# Altium schematic sheet Temperature Sensing 12S V0.1.SchDoc
size A4; SheetNumber: 8; SheetTotal: 9
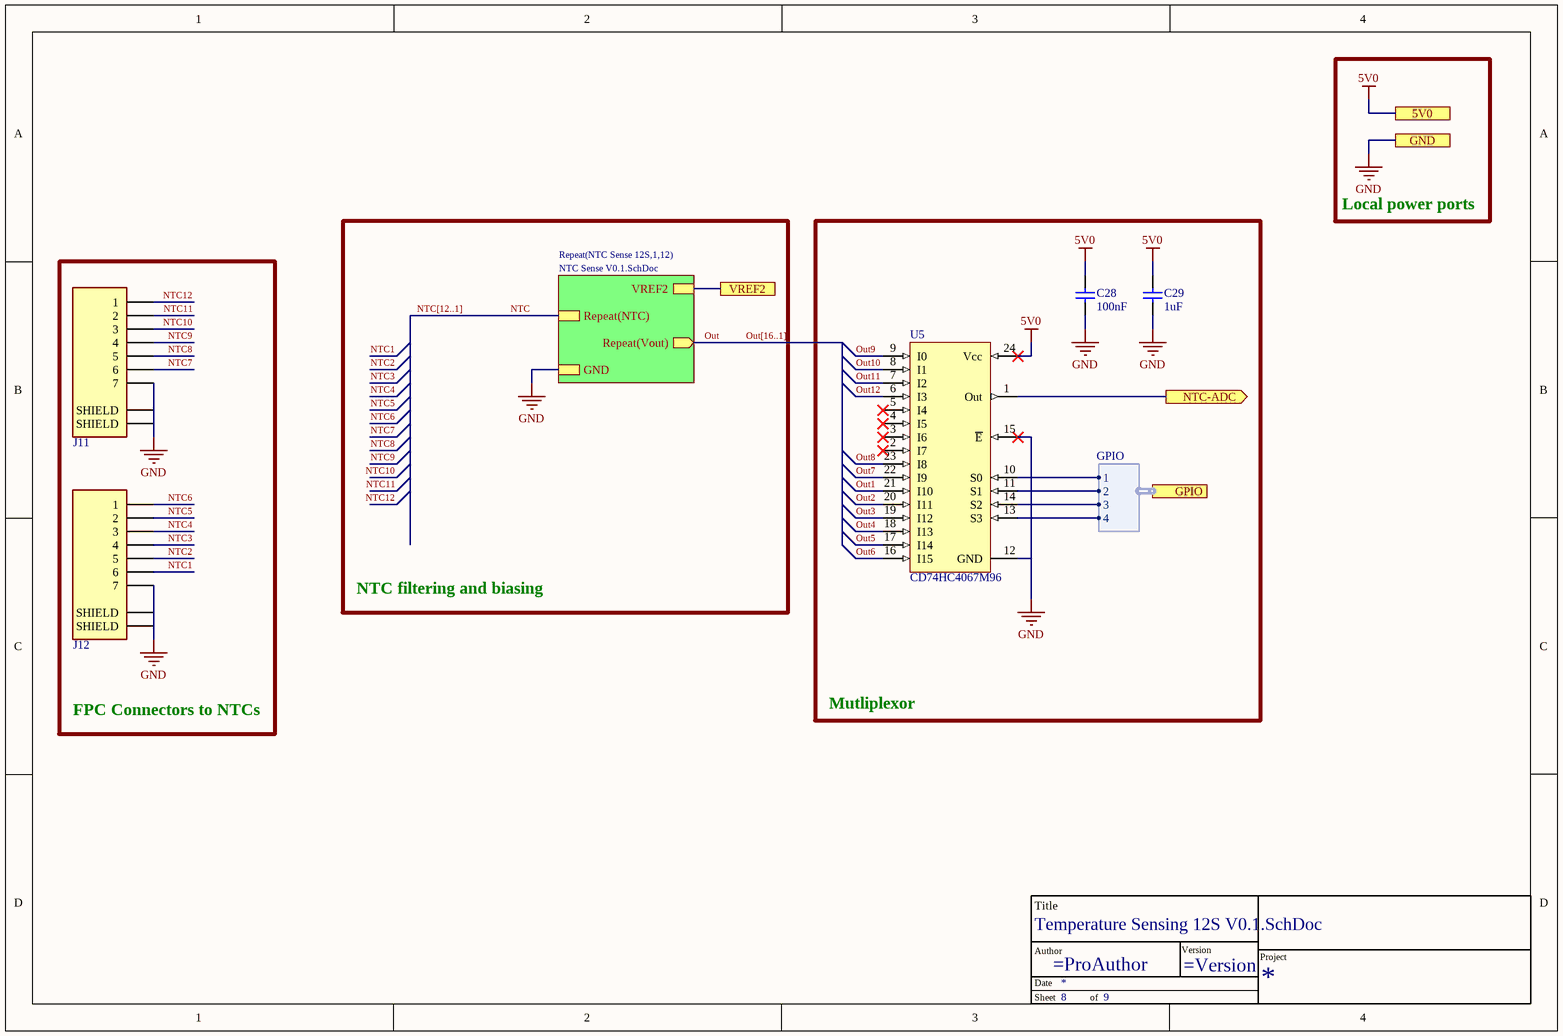
[diagram p0: Temperature Sensing 12S V0.1.SchDoc]

## Parts
*?  TitleBlock  (value not drawn)  (graphical)
C28  value 100nF  [C_0402]  (hidden comment: GRM155R62A104KE14D)
C29  value 1uF  [C_0402]  (hidden comment: EMK105BJ105KV-F)
J11  84953-7  [84953-7]  (value not drawn)
J12  84953-7  [84953-7]  (value not drawn)
U5  CD74HC4067M96  [SOIC127P1030X265-24N]

## Blocks framed on the sheet
Mutliplexor: C28 C29 U5
FPC Connectors to NTCs: J11 J12

## Sub-sheets
Repeat(NTC Sense 12S,1,12) = NTC Sense V0.1.SchDoc: VREF2, Repeat(Vout) (out), Repeat(NTC), GND

## Ports
5V0, GND, GPIO (harness GPIO), NTC-ADC (out), VREF2

## Harnesses
GPIO: 4, 3, 2, 1

## Nets
5V0: C28.1 C29.2 U5.24(Vcc) ; port 5V0
GND: C28.2 C29.1 J11.7 J11.S1(SHIELD) J11.S2(SHIELD) J12.7 J12.S1(SHIELD) J12.S2(SHIELD) U5.12(GND) U5.15(~{E}) ; port GND, sheet Repeat(NTC Sense 12S,1,12)/GND
NTC: sheet Repeat(NTC Sense 12S,1,12)/Repeat(NTC)
NTC1: J12.6
NTC2: J12.5
NTC3: J12.4
NTC4: J12.3
NTC5: J12.2
NTC6: J12.1
NTC7: J11.6
NTC8: J11.5
NTC9: J11.4
NTC10: J11.3
NTC11: J11.2
NTC12: J11.1
NTC-ADC: U5.1(Out) ; port NTC-ADC
Out: sheet Repeat(NTC Sense 12S,1,12)/Repeat(Vout)
Out1: U5.21(I10)
Out2: U5.20(I11)
Out3: U5.19(I12)
Out4: U5.18(I13)
Out5: U5.17(I14)
Out6: U5.16(I15)
Out7: U5.22(I9)
Out8: U5.23(I8)
Out9: U5.9(I0)
Out10: U5.8(I1)
Out11: U5.7(I2)
Out12: U5.6(I3)
VREF2: port VREF2, sheet Repeat(NTC Sense 12S,1,12)/VREF2
NetU5_10: U5.10(S0) ; port GPIO.1
NetU5_11: U5.11(S1) ; port GPIO.2
NetU5_13: U5.13(S3) ; port GPIO.4
NetU5_14: U5.14(S2) ; port GPIO.3

Not connected (* = marked no-connect by the designer): U5 2(I7)* 3(I6)* 4(I5)* 5(I4)*

## Buses and harness runs
bus NTC[12..1]
bus Out[16..1]

## Notes on the sheet
- Local power ports
- NTC filtering and biasing
- (in symbol TitleBlock) Title; Author; Version; Project; Date; Sheet; of

## Library data of the parts
C28 C29 = Capacitor: ComponentLink1Description: New link; ComponentLink1URL: *
  C28: Manufacture Part Number 1: GRM155R62A104KE14D
J11 J12 = 84953-7: FPC Connectors, Flex-to-Board, 7 Position, .039 in [1 mm] Centerline, Zero Insertion Force (ZIF), Right Angle, Surface Mount; Manufacturer: TE Connectivity; Current Rating: 1A; Number of Contacts: 7; Shielding: Unshielded; Gender: Female; Voltage Rating: 200V; Connector Type: Receptacle,Connector,Socket; Wire/Cable Type: Flat Flex; Mating Alignment: Yes (With); PCB Mount Alignment: No (Without); PCB Mount Retention: With; Contact Location: Top; Pitch: 0.039inch; Plating Thickness: 2um; Supplier 1: Mouser; Manufacturer Part Number: 84953-7; RoHS: Yes; Category: FFC / FPC; Pricing 1: 1=0.96000, 10=0.78800, 50=0.78800, 100=0.68800, 500=0.59100, 1000=0.52600, 1500=0.47600, 4500=0.45900, 9000=0.43600, 10000=0.43600, 24000=0.42600 (USD); Mount: Surface Mount; Contact Material: Bronze; Contact Plating: Tin,Bright; Housing Color: Natural; Housing Material: Polymer; Min Operating Temperature: -40°C; Max Operating Temperature: 85°C; Termination: SMD/SMT; Package Quantity: 1500; Number of Rows: 1; Packaging: Tape and Reel; Orientation: Right Angle; Number of Positions: 7; Connector System: Flex-to-Board; PCB Mounting Orientation: Right Angle; Sealable: No (Without); Shrouded: Yes (With); Contact Current Rating: 1A; Max Voltage Rating (AC): 200V; Series: FPC; Length: 0.5866inch; Width: 0.2575inch; Height: 2.56mm; Depth: 7.3mm; Radiation Hardening: No; ELV: Compliant; REACH SVHC: Unknown; Flammability Rating: UL94 V-0; RoHS Compliant: Yes; ComponentLink1URL: https://datasheet.ciiva.com/669/eng-cd-84953-a3-669227.pdf?src-supplier=Digi-Key; ComponentLink1Description: https://datasheet.ciiva.com/669/eng-cd-84953-a3-669227.pdf?src-supplier=Digi-Key; ComponentLink2URL: https://datasheet.ciiva.com/669/eng-cd-84953-a3-669228.pdf?src-supplier=Digi-Key; ComponentLink2Description: https://datasheet.ciiva.com/669/eng-cd-84953-a3-669228.pdf?src-supplier=Digi-Key; ComponentLink3URL: https://datasheet.ciiva.com/30243/eng-ds-1-1773440-6-0506-30243340.pdf?src-supplier=Onlinecomponents.com; ComponentLink3Description: https://datasheet.ciiva.com/30243/eng-ds-1-1773440-6-0506-30243340.pdf?src-supplier=Onlinecomponents.com; ComponentLink4URL: https://datasheet.ciiva.com/16659/eng-ds-1-1773440-6-0506-16659033.pdf?src-supplier=Avnet+Europe; ComponentLink4Description: https://datasheet.ciiva.com/16659/eng-ds-1-1773440-6-0506-16659033.pdf?src-supplier=Avnet+Europe; ComponentLink5URL: https://datasheet.ciiva.com/669/eng-cd-84953-a3-669226.pdf?src-supplier=Digi-Key; ComponentLink5Description: https://datasheet.ciiva.com/669/eng-cd-84953-a3-669226.pdf?src-supplier=Digi-Key; ComponentLink6URL: https://datasheet.ciiva.com/15177/getdatasheetpartid-565061-15177031.pdf?src-supplier=Verical; ComponentLink6Description: https://datasheet.ciiva.com/15177/getdatasheetpartid-565061-15177031.pdf?src-supplier=Verical; ComponentLink7URL: https://datasheet.ciiva.com/10034/eng-ds-1-1773440-6-0506-10034350.pdf?src-supplier=Avnet; ComponentLink7Description: https://datasheet.ciiva.com/10034/eng-ds-1-1773440-6-0506-10034350.pdf?src-supplier=Avnet; Supplier Part Number 1: 571-84953-7
U5 = CD74HC4067M96: High-Speed CMOS Logic / 16-Channel Analog Multiplexer/Demultiplexer